# EAGLE design ow (EAGLE 7.6.0)
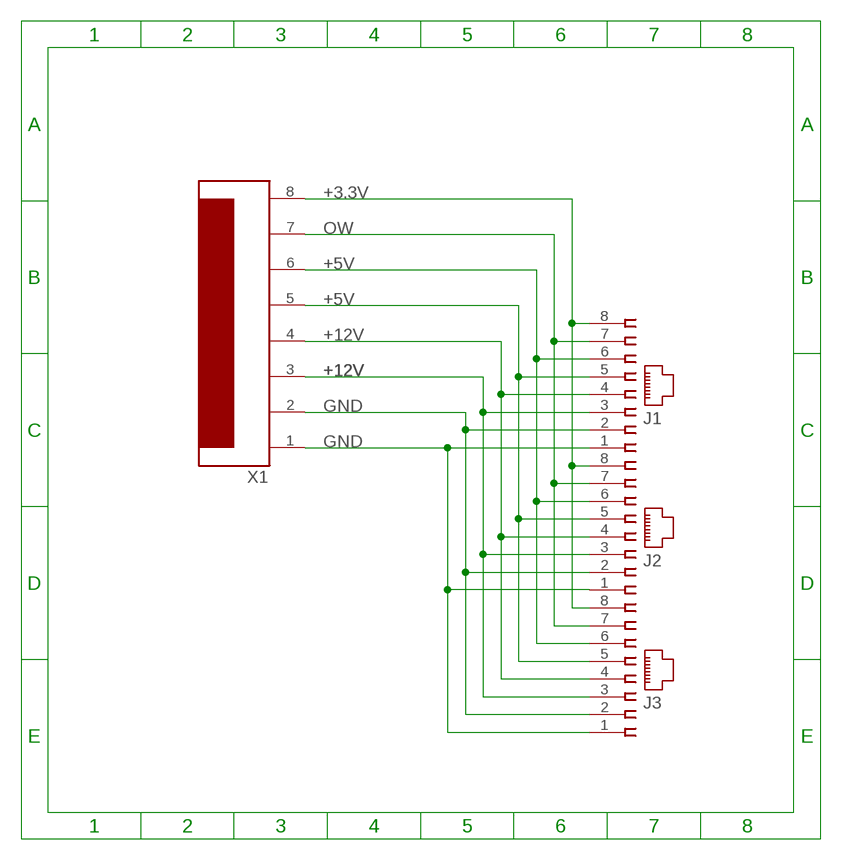
[diagram p0: schematic, sheet 1]

## Parts
J1  215877-4  [215877-4]
J2  215877-4  [215877-4]
J3  215877-4  [215877-4]
X1  1WIRE-CON  [KK-156-8]

## Nets
+3.3V: J1.8 J2.8 J3.8 X1.8
+5V: J1.5 J1.6 J2.5 J2.6 J3.5 J3.6 X1.5 X1.6
+12V: J1.3 J1.4 J2.3 J2.4 J3.3 J3.4 X1.3 X1.4
GND: J1.1 J1.2 J2.1 J2.2 J3.1 J3.2 X1.1 X1.2
OW: J1.7 J2.7 J3.7 X1.7

## Library data of the parts
J1-J3 = Custom:215877-4: AMP connector
X1 = Custom:1WIRE-CON: KK 156 HEADER Source: http://www.molex.com/pdm_docs/sd/026604100_sd.pdf; OC_FARNELL: unknown; OC_NEWARK: unknown

## Net classes
0 default: width 0.254 mm

## Board
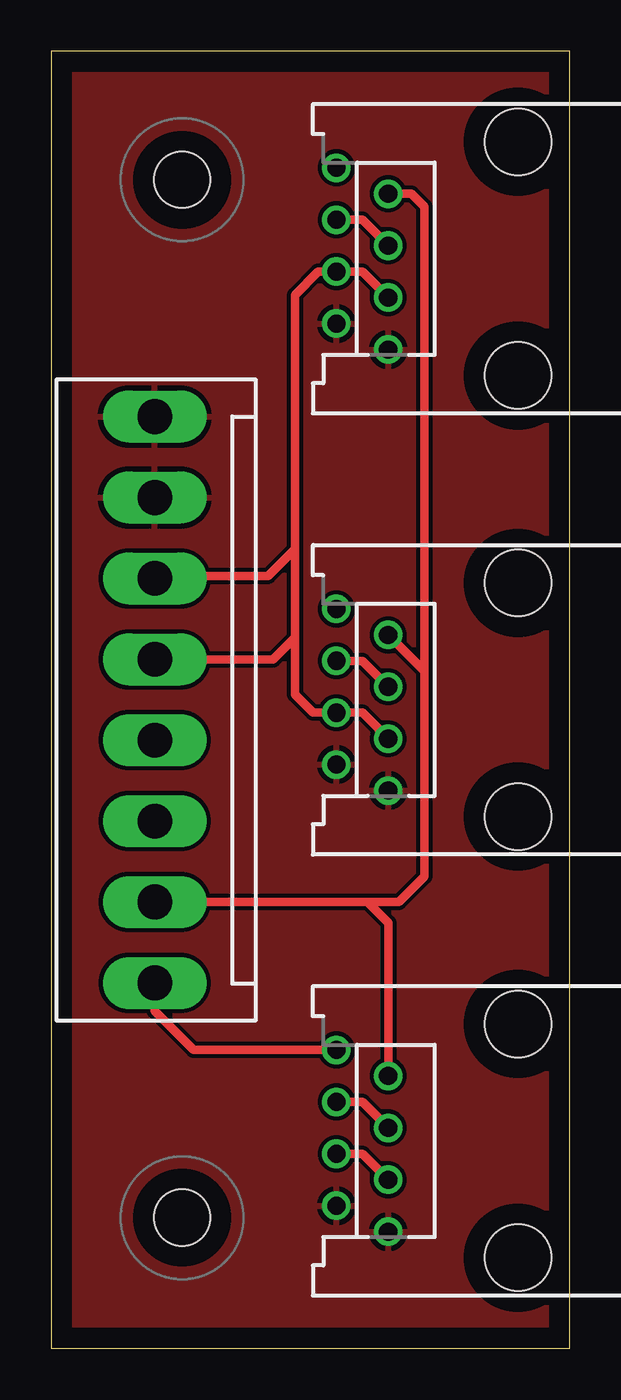
[diagram p1: board, top side]
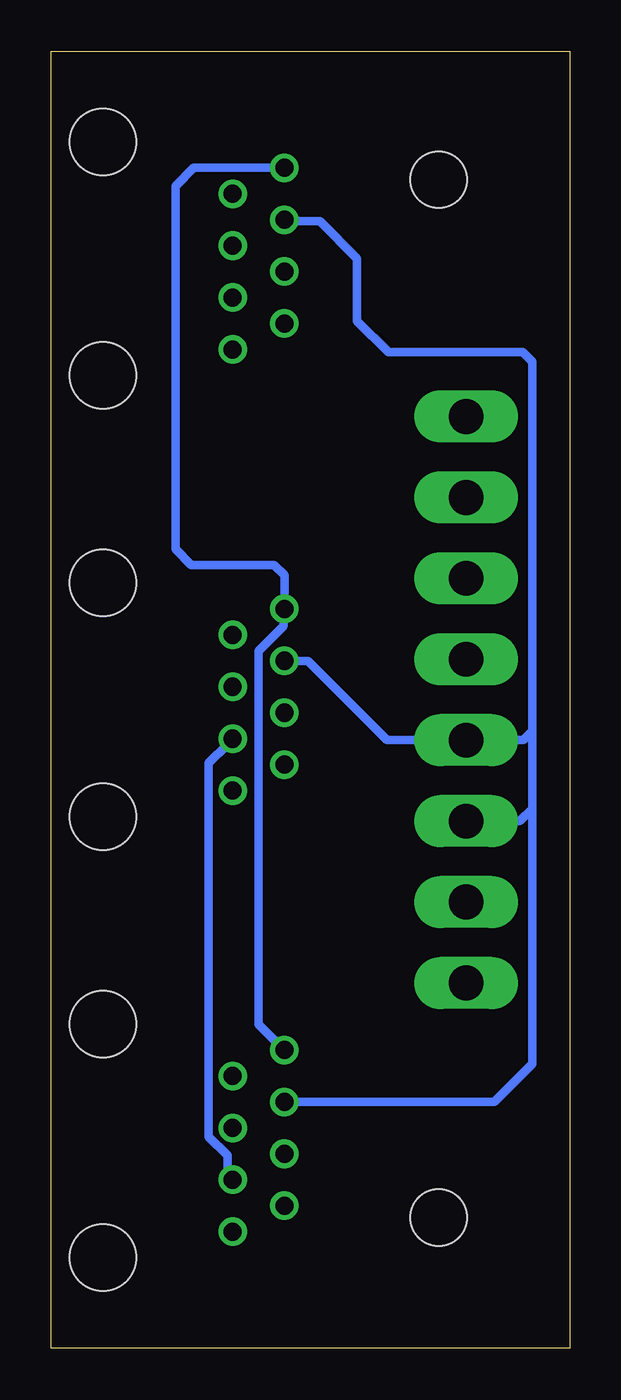
[diagram p2: board, bottom side, seen from below]

Size 25.4 x 63.5 mm. Coordinates in mm from the lower left corner, seen from the top.
Outline: 0,0 25.4,0 25.4,63.5 0,63.5 0,0
Copper layers (1*16): Top 0.035mm / dielectric 1.5mm / Bottom 0.035mm
Design rules "default": minimum track width 10mil, minimum drill 24mil, track to track 8mil, track to pad 8mil, pad to pad 8mil, via to via 8mil, smd to smd 8mil, copper to edge 40mil, drill to drill 8mil, minimum pad ring 10mil, minimum via ring 8mil, stop-mask expansion 4mil, vias tented up to drill 0mil, thermal gap 10mil
Holes 2.75 mm at 6.42,6.4 6.42,57.2

### Footprints (pad centres in the part's own frame; a part is rotated, then mirrored left to right if it is on the bottom)
215877-4 = drill 0.889: 1 -4.445,6.35; 2 -3.175,8.89; 3 -1.905,6.35; 4 -0.635,8.89; 5 0.635,6.35; 6 1.905,8.89; 7 3.175,6.35; 8 4.445,8.89 | hole 3.251: -5.715,0; 5.715,0
KK-156-8 = drill 1.7 pad 2.184 long: 1 -13.86,0; 2 -9.9,0; 3 -5.94,0; 4 -1.98,0; 5 1.98,0; 6 5.94,0; 7 9.9,0; 8 13.86,0

### Placement (x,y rotation side)
J1  22.86,53.34 90 top
J2  22.86,31.75 90 top
J3  22.86,10.16 90 top
X1  5.08,31.75 270 top

### Tracks (layer width: path | path; a pad name or v marks a point on that pad's centre or on a via)
+3.3V
  Top 0.406: X1.8 5.08,16.51 6.99,14.61 J3.8
  Bottom 0.406: J3.8 14.02,14.63 15.24,15.85 15.24,34.14 14.02,35.36 14.02,35.97 J2.8 13.97,37.85 14.48,38.35 18.54,38.35 19.3,39.12 19.3,56.9 18.41,57.78 J1.8
+5V
  Top 0.406: J3.6 15.24,12.06 J3.5 | J2.6 15.24,33.66 J2.5 | J1.6 15.24,55.24 J1.5
  Bottom 0.406: J1.6 13.72,55.17 12.24,55.17 10.41,53.34 10.41,50.29 8.89,48.77 2.29,48.77 1.83,48.31 1.83,30.23 | J3.6 3.68,12.06 1.83,13.92 1.83,26.42 | 1.83,30.23 1.83,26.42 | 1.83,30.23 2.29,29.77 X1.5 8.94,29.77 12.83,33.66 J2.6 | X1.6 2.44,25.81 1.83,26.42
+12V  (via drill 0.6)
  Top 0.406: J3.4 15.24,9.53 J3.3 | J2.3 15.24,31.11 J2.4 12.83,31.11 11.94,32 11.94,34.8 | J1.3 15.24,52.7 J1.4 13.08,52.7 11.94,51.56 11.94,39.12 | v5.18,37.8 10.62,37.8 11.94,39.12 | X1.4 10.87,33.73 11.94,34.8 | 11.94,39.12 11.94,34.8
  Bottom 0.406: J3.3 16.76,8.53 16.76,9.45 17.68,10.36 17.68,28.65 16.76,29.57 J2.3 | 16.46,51.21 J1.3 | v5.18,37.8 X1.3
GND
  pour Top: -0.76,64.26 -0.76,-1.27 26.16,-1.27 26.16,-0.51 26.16,64.52 -0.76,64.52
OW
  Top 0.406: J3.7 16.51,20.83 15.49,21.85 | 18.29,33.15 18.29,23.11 17.02,21.85 15.49,21.85 | 18.29,33.15 J2.7 | J1.7 17.65,56.52 18.29,55.88 18.29,33.15 | X1.7 15.49,21.85